# EAGLE design Digital_Output_B (EAGLE 9.5.1)
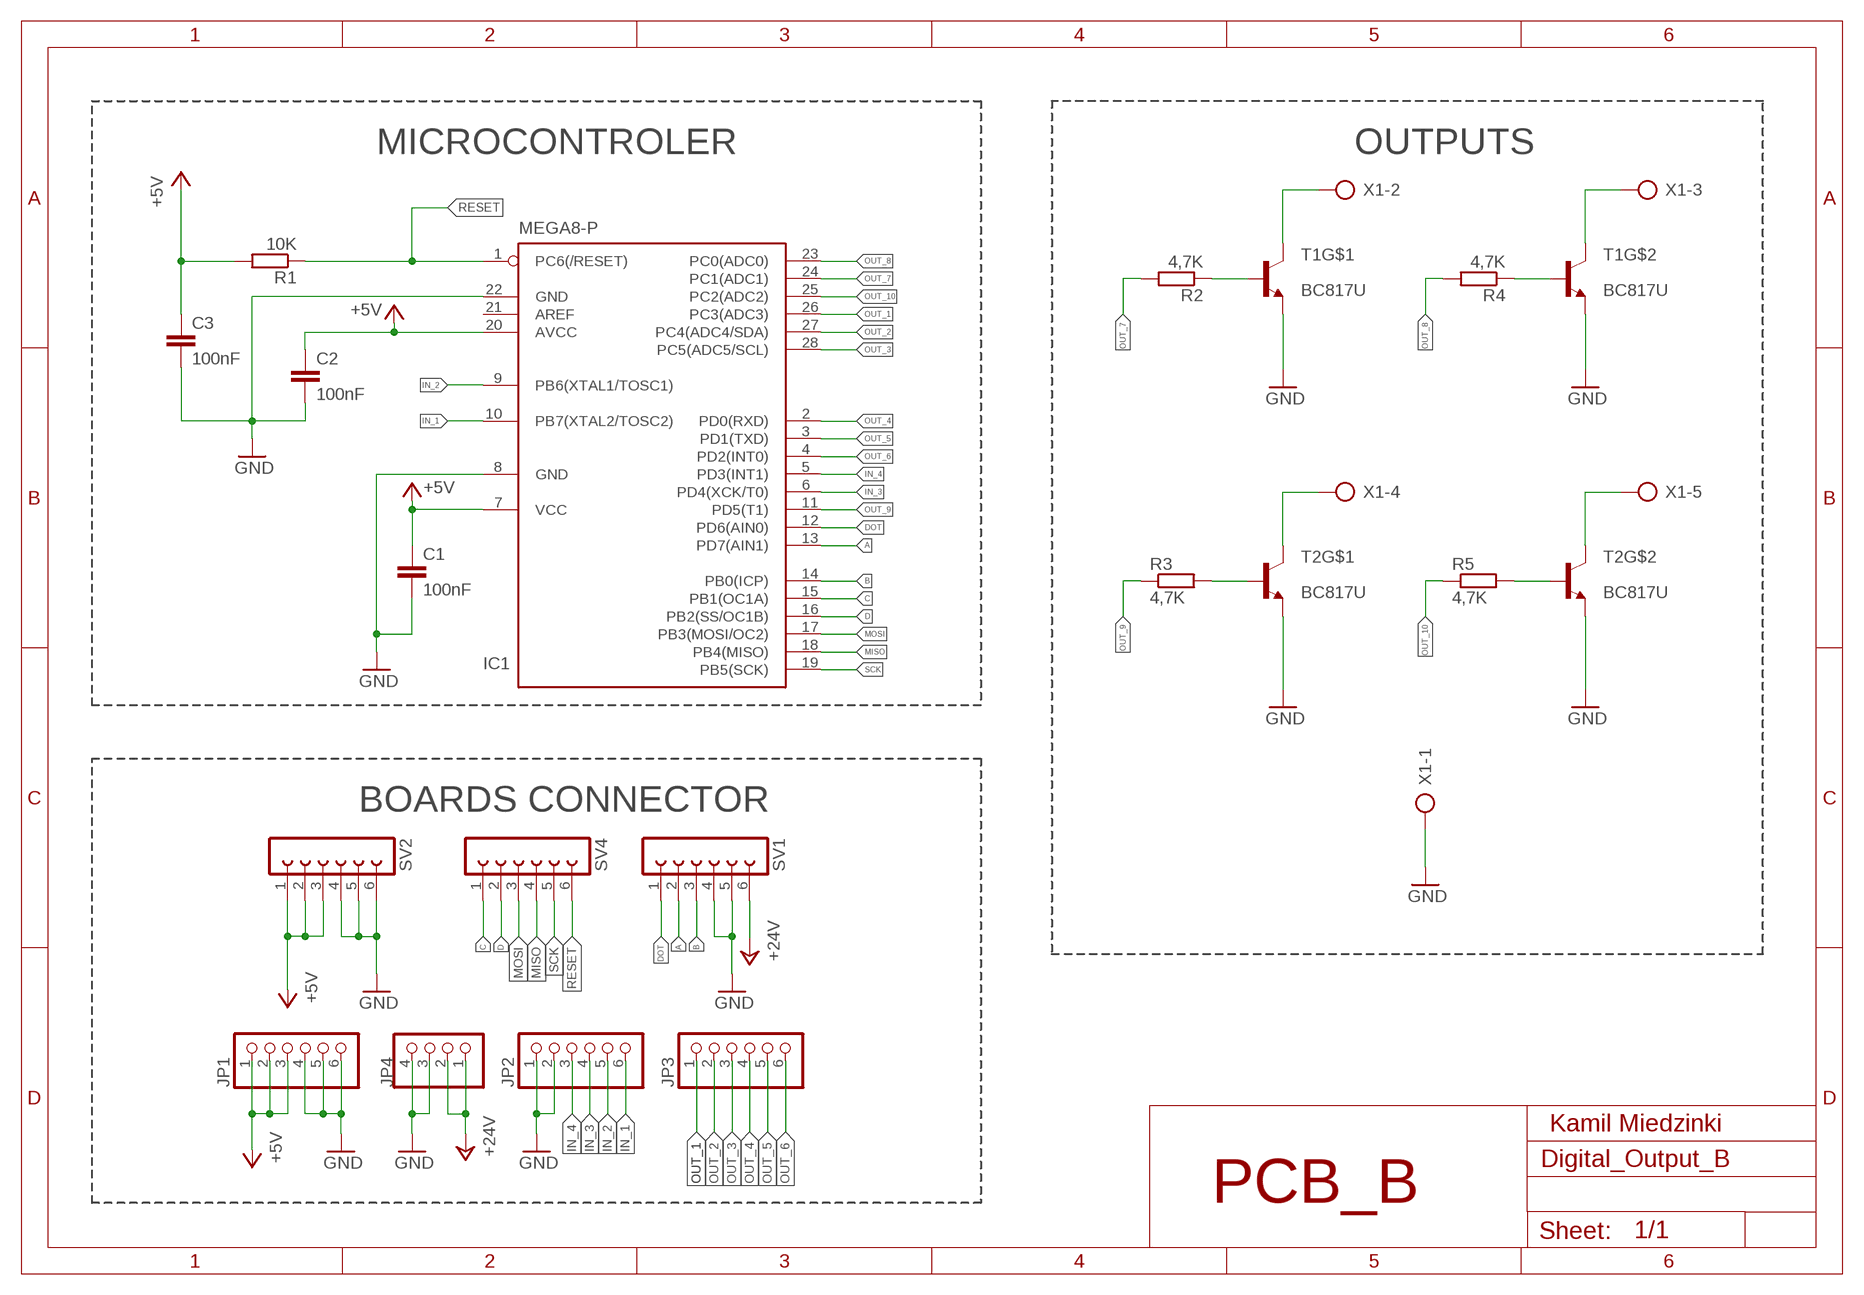
[diagram p0: schematic, sheet 1]

## Parts
C1  100nF  C-EUC0805K  [C0805K]
C2  100nF  C-EUC0805K  [C0805K]
C3  100nF  C-EUC0805K  [C0805K]
IC1  MEGA8-P  [DIL28-3]
JP1  PINHD-1X6"  [1X06H]
JP2  PINHD-1X6"  [1X06H]
JP3  PINHD-1X6"  [1X06H]
JP4  PINHD-1X41X04H  [1X04H]
R1  10K  R-EU_R0805  [R0805]
R2  4,7K  R-EU_R0805  [R0805]
R3  4,7K  R-EU_R0805  [R0805]
R4  4,7K  R-EU_R0805  [R0805]
R5  4,7K  R-EU_R0805  [R0805]
SV1  FE06-1  [FE06]
SV2  FE06-1  [FE06]
SV4  FE06-1  [FE06]
T1  BC817U  [INF-SC74]
T2  BC817U  [INF-SC74]
X1  MKDS_3/5  [MKDS_3/5]

## Nets
+5V: C1.1 C2.1 C3.1 IC1.7(VCC) IC1.20(AVCC) JP1.1 JP1.2 JP1.3 R1.2 SV2.1 SV2.2 SV2.3
+24V: JP4.1 JP4.2 SV1.6
A: IC1.13(PD7(AIN1)) SV1.2
B: IC1.14(PB0(ICP)) SV1.3
C: IC1.15(PB1(OC1A)) SV4.1
D: IC1.16(PB2(SS/OC1B)) SV4.2
DOT: IC1.12(PD6(AIN0)) SV1.1
GND: C1.2 C2.2 C3.2 IC1.8(GND) IC1.22(GND) JP1.4 JP1.5 JP1.6 JP2.1 JP2.2 JP4.3 JP4.4 SV1.4 SV1.5 SV2.4 SV2.5 SV2.6 T1.1(E) T1.4(E) T2.1(E) T2.4(E) X1.1
IN_1: IC1.10(PB7(XTAL2/TOSC2)) JP2.6
IN_2: IC1.9(PB6(XTAL1/TOSC1)) JP2.5
IN_3: IC1.6(PD4(XCK/T0)) JP2.4
IN_4: IC1.5(PD3(INT1)) JP2.3
MISO: IC1.18(PB4(MISO)) SV4.4
MOSI: IC1.17(PB3(MOSI/OC2)) SV4.3
N$1: T2.6(C) X1.4
N$2: T2.3(C) X1.5
N$3: T1.3(C) X1.3
N$4: T1.6(C) X1.2
N$5: R2.1 T1.2(B)
N$6: R3.2 T2.2(B)
N$7: R4.1 T1.5(B)
N$8: R5.2 T2.5(B)
OUT_1: IC1.26(PC3(ADC3)) JP3.1
OUT_2: IC1.27(PC4(ADC4/SDA)) JP3.2
OUT_3: IC1.28(PC5(ADC5/SCL)) JP3.3
OUT_4: IC1.2(PD0(RXD)) JP3.4
OUT_5: IC1.3(PD1(TXD)) JP3.5
OUT_6: IC1.4(PD2(INT0)) JP3.6
OUT_7: IC1.24(PC1(ADC1)) R2.2
OUT_8: IC1.23(PC0(ADC0)) R4.2
OUT_9: IC1.11(PD5(T1)) R3.1
OUT_10: IC1.25(PC2(ADC2)) R5.1
RESET: IC1.1(PC6(/RESET)) R1.1 SV4.6
SCK: IC1.19(PB5(SCK)) SV4.5
Unconnected: IC1.21(AREF)

## Notes on the sheet
- MICROCONTROLER | OUTPUTS
- BOARDS CONNECTOR
- Kamil Miedzinki
- PCB_B

## Library data of the parts
C1-C3 = rcl:C-EU: CAPACITOR, European symbol; SPICEPREFIX: C
IC1 = atmel:MEGA8-P: MICROCONTROLLER 8 Kbytes FLASH, 1 kbytes SRAM, 512 bytes EEPROM, USART, 4-channel 10 bit ADC, 2-channel 8 bit ADC Pin compatible with Atmega48, ATMega88, ATMega168 Source: avr.lbr; OC_FARNELL: unknown; OC_NEWARK: unknown
JP1-JP3 = pinhead:PINHD-1X6: PIN HEADER
JP4 = pinhead:PINHD-1X4: PIN HEADER
R1-R5 = rcl:R-EU_: RESISTOR, European symbol; SPICEPREFIX: R
SV1 SV2 SV4 = con-lsta:FE06-1: FEMALE HEADER; OC_FARNELL: unknown; OC_NEWARK: unknown
T1 T2 = transistor:BC817U: NPN TRANSISTOR
X1 = con-ptr500:MKDS_3/5: CONNECTOR; OC_FARNELL: unknown; OC_NEWARK: unknown

## Board
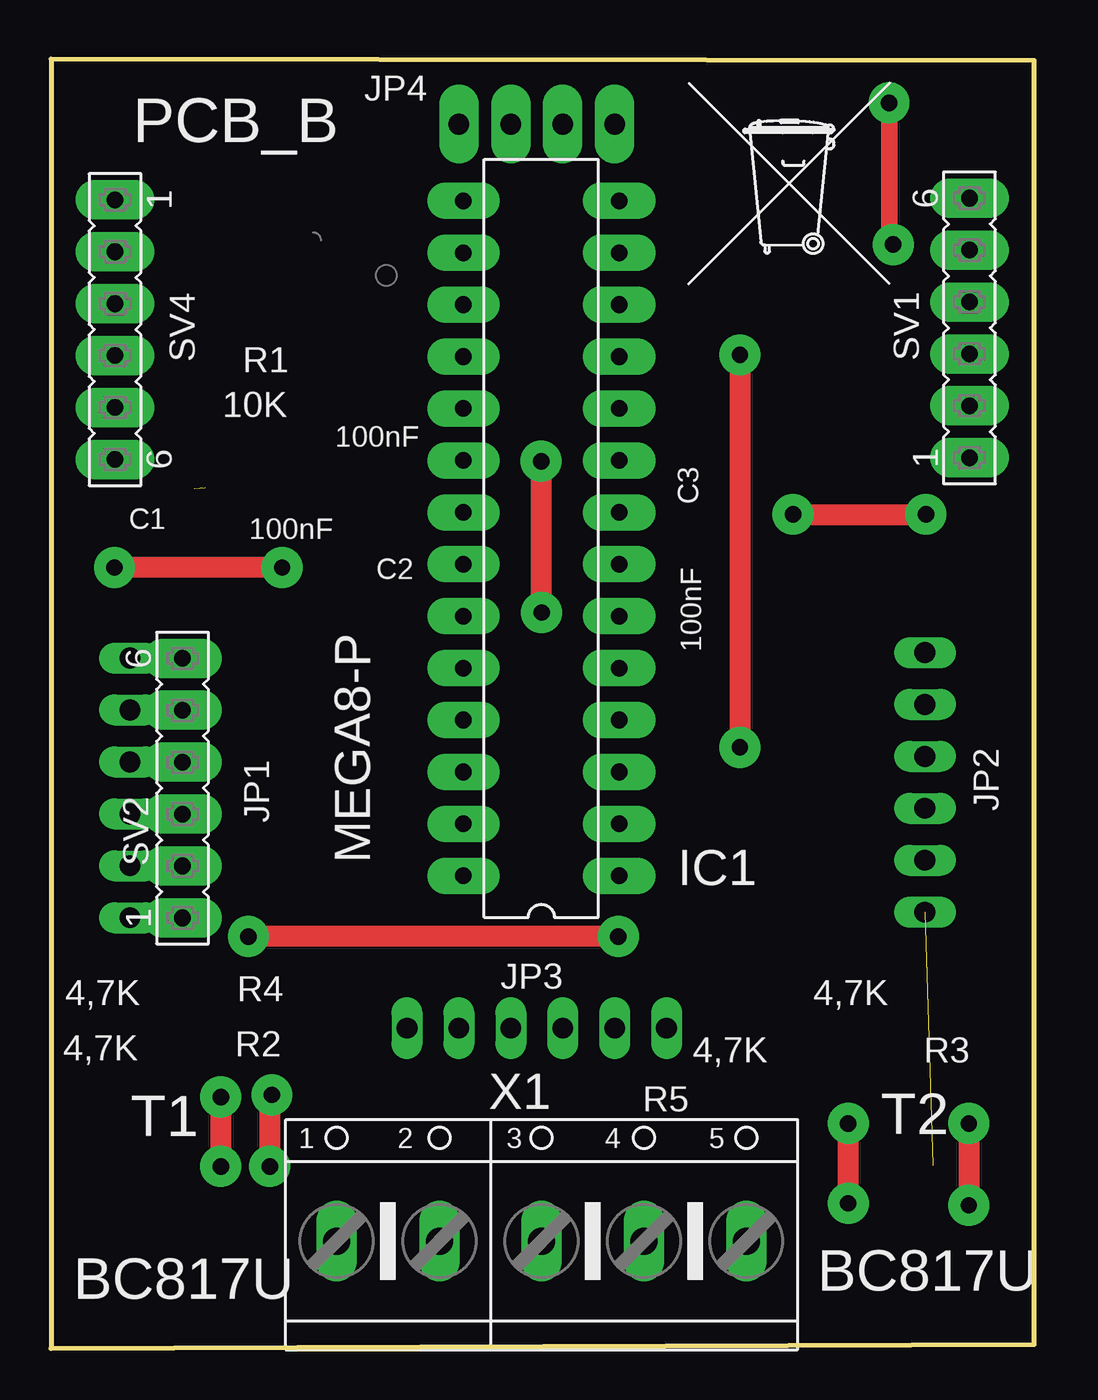
[diagram p1: board, top side]
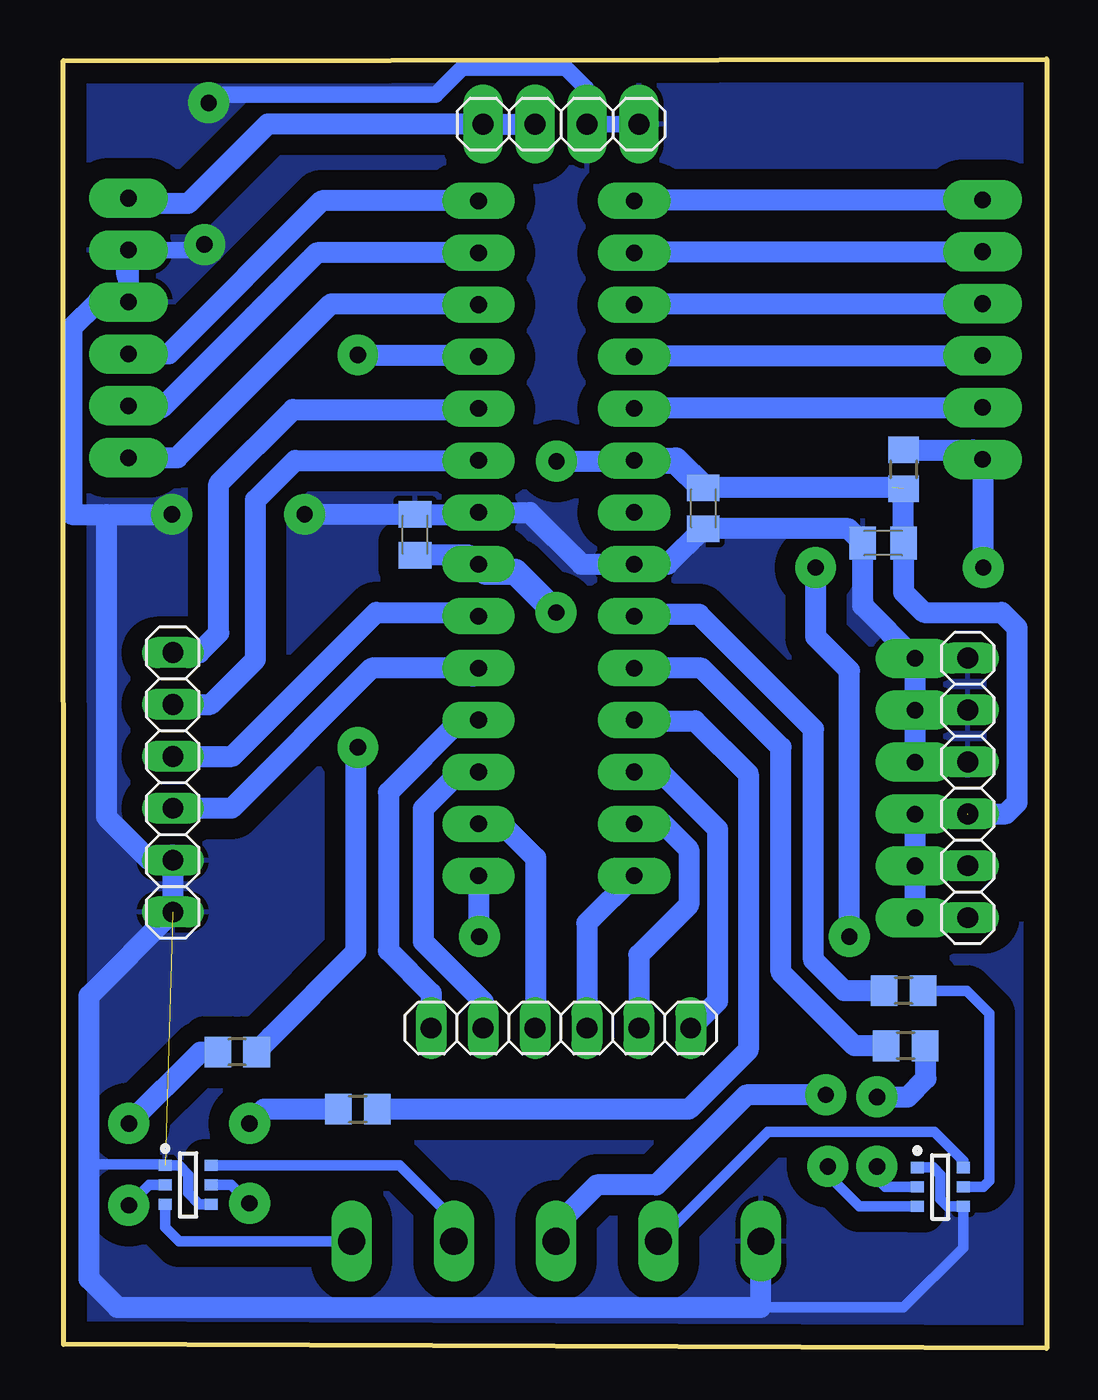
[diagram p2: board, bottom side, seen from below]

Size 48.1 x 63.07 mm. Coordinates in mm from the lower left corner, seen from the top.
Outline: 48.1,63 0,63.07 0,0 48.1,0.2 48.1,63
Copper layers (1*16): Top 0.035mm / dielectric 1.5mm / Bottom 0.035mm
Design rules "default": minimum track width 6mil, minimum drill 0.35mm, track to track 6mil, track to pad 6mil, pad to pad 6mil, via to via 6mil, smd to smd 6mil, copper to edge 40mil, drill to drill 6mil, minimum pad ring 10mil, minimum via ring 8mil, stop-mask expansion 4mil, vias tented up to drill 0mil, thermal gap 10mil

### Footprints (pad centres in the part's own frame; a part is rotated, then mirrored left to right if it is on the bottom)
C0805K = smd 1.3 x 1.6: 1 -1,0; 2 1,0
DIL28-3 = drill 0.813 pad 1.778 long: 1 -16.51,-3.81; 2 -13.97,-3.81; 3 -11.43,-3.81; 4 -8.89,-3.81; 5 -6.35,-3.81; 6 -3.81,-3.81; 7 -1.27,-3.81; 8 1.27,-3.81; 9 3.81,-3.81; 10 6.35,-3.81; 11 8.89,-3.81; 12 11.43,-3.81; 13 13.97,-3.81; 14 16.51,-3.81; 15 16.51,3.81; 16 13.97,3.81; 17 11.43,3.81; 18 8.89,3.81; 19 6.35,3.81; 20 3.81,3.81; 21 1.27,3.81; 22 -1.27,3.81; 23 -3.81,3.81; 24 -6.35,3.81; 25 -8.89,3.81; 26 -11.43,3.81; 27 -13.97,3.81; 28 -16.51,3.81
1X06H = drill 1.016 long: 1 -6.35,0; 2 -3.81,0; 3 -1.27,0; 4 1.27,0; 5 3.81,0; 6 6.35,0
1X04H = drill 1.016 pad 1.93 long: 1 -3.81,0; 2 -1.27,0; 3 1.27,0; 4 3.81,0
R0805 = smd 1.3 x 1.5: 1 -0.95,0; 2 0.95,0
FE06 = drill 0.813 pad 1.93 long: 1 -6.35,0; 2 -3.81,0; 3 -1.27,0; 4 1.27,0; 5 3.81,0; 6 6.35,0
INF-SC74 = smd 0.65 x 0.55: 1 -1.125,0.95; 2 -1.125,0; 3 -1.125,-0.95; 4 1.125,-0.95; 5 1.125,0; 6 1.125,0.95
MKDS_3/5 = drill 1.321 long: 1 -10.033,0; 2 -5.004,0; 3 0,0; 4 5.004,0; 5 10.008,0

### Placement (x,y rotation side)
C1  8,39.4 180 bottom
C2  16.8,41.1 270 bottom
C3  30.9,39.8 90 bottom
IC1  23.98,39.63 90 top
JP1  3.86,27.42 90 bottom
JP2  42.75,27.69 90 bottom
JP3  23.76,15.67 180 bottom
JP4  23.76,59.89 0 bottom
R1  7,43 270 bottom
R2  6.9,14.8 180 bottom
R3  39.6,14.5 180 bottom
R4  7,17.5 180 bottom
R5  33.7,11.7 180 bottom
SV1  44.93,49.92 90 top
SV2  6.43,27.41 90 top
SV4  3.13,49.84 270 top
T1  5.2,7.9 0 bottom
T2  42,8 0 bottom
U$1  [LOGO]  9,52 0 top
U$2  [TONNE_10.00]  36,55 0 top
X1  24,5.25 0 top

### Tracks (layer width: path | path; a pad name or v marks a point on that pad's centre or on a via)
+5V  (via drill 0.8 pad 2)  (2 unrouted)
  Top 1.016: v24,36 24,43.4 v23.98,43.4
  Bottom 0.813: IC1.7 28.24,38.8
  Bottom 1.016: JP1.3 SV2.3 SV2.2 | 28.24,38.8 C3.1 | JP1.1 SV2.1 SV2.2 | JP1.2 SV2.2 | 7.54,42.1 C2.1 | v23.98,43.4 20.21,43.4 IC1.20 | R1.2 C1.1 7,37 6,36 2.2,36 1.45,35.25 1.45,26.7 2,26.15 JP1.3
  Bottom 1.27: IC1.20 18.14,43.44 C2.1 | IC1.7 27.44,38 26,38 v24,36
+24V
  Bottom 1.016: JP4.2 JP4.1 38.11,59.89 42,56 44.66,56 SV1.6
A
  Bottom 1.016: IC1.13 35.7,53.6 43.3,46 44.82,46 SV1.2
B
  Bottom 1.016: IC1.14 35.46,56.14 42.95,48.65 SV1.3
C
  Bottom 0.508: IC1.15 20.12,56.19
  Bottom 1.016: 20.12,56.19 SV4.1
D
  Bottom 0.508: IC1.16 20.12,53.65
  Bottom 1.016: 20.12,53.65 SV4.2
DOT
  Bottom 1.016: SV1.1 42.53,43.57 35,51.1 27.84,51.1 IC1.12
GND  (via drill 0.8 pad 2)  (1 unrouted)
  Top 0.813: v41.2,54 41,54.2 v41,60.93 41,61
  Top 1.016: v36.3,40.8 v42.8,40.8
  Bottom 0.508: T1.1 5.55,8.85 5.2,8.5 5.2,7.3 4.85,6.95 T1.4 4.08,4.92 7,2 14,2 | T2.4 41.45,7.05 42,7.6 42,8.5 42.45,8.95 T2.1 43.17,9 46.7,9 46.65,8.95
  Bottom 0.813: IC1.8 27.89,40.8 | SV1.5 41.47,53.73 v41.2,54 | JP4.4 JP4.3 22.54,59.94 22.54,61.65 23.54,62.65 28.56,62.65 29.88,61.33 40.6,61.33 v41,60.93
  Bottom 1.016: SV2.6 9,36.33 C1.2 9.7,40.1 C2.2 18.54,38.36 IC1.22 22.76,38.36 25.3,40.9 IC1.8 | 27.89,40.8 C3.2 v36.3,40.8 | SV2.5 SV2.4 JP1.4 | SV2.5 SV2.6 | JP1.6 SV2.6 | JP1.5 SV2.5 | 13.97,4.03 X1.1 14,5.22 14,2 45.45,2 46.85,3.4 46.85,17.25 JP2.1 JP2.2 43.88,23.88 46,26 46,40.8 | 45,52.5 45,53.66 SV1.5 SV1.4 46.43,51.19 47.69,49.93 47.69,40.8 46,40.8 | 46,40.8 v42.8,40.8
  pour Bottom (isolate 1): 0,63.07 0,0 48.1,0.2 48.1,63
IN_1
  Bottom 1.016: IC1.10 27.84,45.93 36.87,45.93 40.5,42.3 40.5,35 41.46,34.04 JP2.6
IN_2
  Bottom 0.508: 27.84,43.39 IC1.9
  Bottom 1.016: JP2.5 40.9,31.5 38.7,33.7 38.7,41.5 36.76,43.44 IC1.9
IN_3
  Bottom 1.016: JP2.4 39.84,28.96 32.8,36 27.98,36
  Bottom 1.27: 27.98,36 IC1.6
IN_4
  Bottom 1.016: IC1.5 33.02,33.28 39.88,26.42 JP2.3
  Bottom 1.27: IC1.5 28.07,33
MISO
  Bottom 0.813: IC1.18 20.12,48.57
  Bottom 1.016: 20.12,48.57 SV4.4
MOSI
  Bottom 0.813: IC1.17 20.12,51.11
  Bottom 1.016: 20.12,51.11 SV4.3
N$1
  Bottom 0.508: T2.6 31.65,8.95 29,6.3 X1.4
N$2
  Bottom 0.508: X1.5 42.45,5.25 43.12,5.92 T2.3
N$3  (via drill 0.8 pad 2)
  Top 1.016: v10.7,8.9 10.7,12.4 v10.8,12.4
  Bottom 0.508: T1.3 9.15,6.95 10.7,8.5 v10.7,8.9
  Bottom 1.016: v10.8,12.4 14.7,12.4 19.1,8 22,8 24,6 X1.3
N$4
  Bottom 0.508: X1.2 13.65,10.6 5.5,10.6 4.08,9.18 T1.6
N$5  (via drill 0.8 pad 2)
  Top 1.016: v8.3,12.3 v8.3,8.9
  Bottom 0.508: T1.2 7.9,7.9 8.3,8.3 v8.3,8.9
  Bottom 1.016: v8.3,12.3 6.8,12.3 5.9,13.2 5.9,14.75 R2.1
N$6  (via drill 0.8 pad 2)
  Top 1.016: v44.9,11 v44.9,7
  Bottom 0.508: v44.9,7 43.9,8 T2.2
  Bottom 1.016: v44.9,11 41.4,14.5 R3.2
N$7
  Bottom 0.508: T1.5 3.1,7.9 2.8,8.2 2.8,16.4 3.9,17.5 R4.1
N$8  (via drill 0.8 pad 2)
  Top 1.016: v39,7.1 v39,11
  Bottom 0.508: T2.5 39.9,8 v39,7.1
  Bottom 1.016: R5.2 38.3,11.7 v39,11
OUT_1
  Bottom 0.813: 18.9,28.2
  Bottom 1.016: IC1.26 18.9,28.2 | JP3.1 16.1,16.98 16.1,25.4 18.9,28.2
OUT_2
  Bottom 0.508: IC1.27 19.43,25.66
  Bottom 1.016: IC1.27 18.76,25.66 17.5,24.4 17.5,21.7 19.95,19.25 JP3.2
OUT_3
  Bottom 1.016: IC1.28 22.49,20.8 JP3.3
OUT_4
  Bottom 0.813: 25,15.7 JP3.4
  Bottom 1.016: IC1.2 26.66,25.66 25,24 25,15.7
OUT_5
  Bottom 1.016: IC1.3 28.7,28.2 30.5,26.4 30.5,19.9 27.57,16.97 JP3.5
OUT_6
  Bottom 1.016: IC1.4 28.66,30.74 32.2,27.2 32.2,19.46 30.11,17.37 JP3.6
OUT_7
  Bottom 1.016: R2.2 9.4,14.8 13,18.4 13,29.4 16.88,33.28 IC1.24
OUT_8
  Bottom 1.016: R4.2 9.9,17.5 11.4,19 11.4,30.3 17,35.9 20.09,35.9 IC1.23
OUT_9  (via drill 0.8 pad 2)
  Top 1.016: v33.7,48.6 v33.7,29.4
  Bottom 1.016: R3.1 37.95,15.25 33.8,19.4 33.8,29.3 v33.7,29.4 | v33.7,48.6 27.88,48.6 IC1.11
OUT_10
  Bottom 1.016: IC1.25 20.14,30.7 17.2,30.7 14.6,28.1 14.6,14.6 17.5,11.7 R5.1
RESET  (via drill 0.8 pad 2)
  Top 1.016: v27.75,20.15 9.75,20.15 9.7,20.2 v9.65,20.15 | v11.3,38.2 v3.1,38.2
  Bottom 1.016: R1.1 3.59,43.95 SV4.6 3.1,43.46 v3.1,38.2 | IC1.1 27.8,20.2 v27.75,20.15 | v9.65,20.15 9.65,33.15 11.3,34.8 v11.3,38.2
SCK
  Bottom 0.813: IC1.19 20.12,46.03
  Bottom 1.016: 20.12,46.03 SV4.5

### Text on the board
tNames: PCB_B